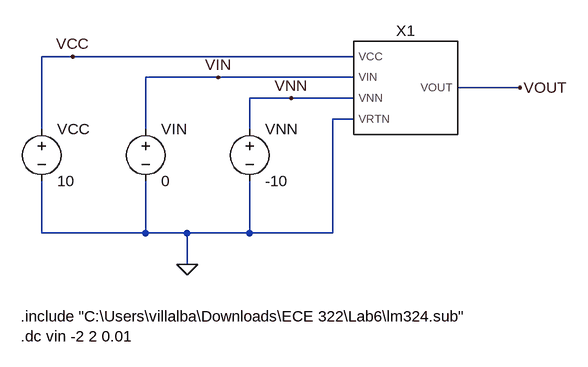
[diagram p0: schematic PreLab6.asc]
PreLab6.asc, the LTspice schematic file:
Version 4
SHEET 1 880 680
WIRE -288 128 -336 128
WIRE 144 128 -288 128
WIRE -64 160 -176 160
WIRE 144 160 -64 160
WIRE 400 176 304 176
WIRE 48 192 -16 192
WIRE 144 192 48 192
WIRE 144 224 112 224
WIRE -336 240 -336 128
WIRE -176 240 -176 160
WIRE -16 240 -16 192
WIRE -336 400 -336 320
WIRE -176 400 -176 320
WIRE -176 400 -336 400
WIRE -112 400 -176 400
WIRE -16 400 -16 320
WIRE -16 400 -112 400
WIRE 112 400 112 224
WIRE 112 400 -16 400
WIRE -112 448 -112 400
FLAG -112 448 0
FLAG 400 176 VOUT
FLAG -64 160 VIN
FLAG -288 128 VCC
FLAG 48 192 VNN
SYMBOL voltage -336 224 R0
WINDOW 123 0 0 Left 0
WINDOW 39 0 0 Left 0
SYMATTR InstName VCC
SYMATTR Value 10
SYMBOL voltage -176 224 R0
WINDOW 123 0 0 Left 0
WINDOW 39 0 0 Left 0
SYMATTR InstName VIN
SYMATTR Value 0
SYMBOL voltage -16 224 R0
WINDOW 123 0 0 Left 0
WINDOW 39 0 0 Left 0
SYMATTR InstName VNN
SYMATTR Value -10
SYMBOL PreLab6_Alex_Villalba.asc 224 176 R0
SYMATTR InstName X1
TEXT -368 528 Left 2 !.include "C:\\Users\\villalba\\Downloads\\ECE 322\\Lab6\\lm324.sub"\n.dc vin -2 2 0.01

The netlist it stands for:
* PreLab6.asc
VCC VCC 0 10
VIN VIN 0 0
VNN VNN 0 -10
XX1 VCC VIN VNN 0 VOUT PreLab6_Alex_Villalba.asc  ; pins VCC VIN VNN VRTN VOUT
.include "C:\Users\villalba\Downloads\ECE 322\Lab6\lm324.sub"
.dc vin -2 2 0.01
.backanno
.end

* Results of the author's LTspice run, read from the files saved beside the schematic
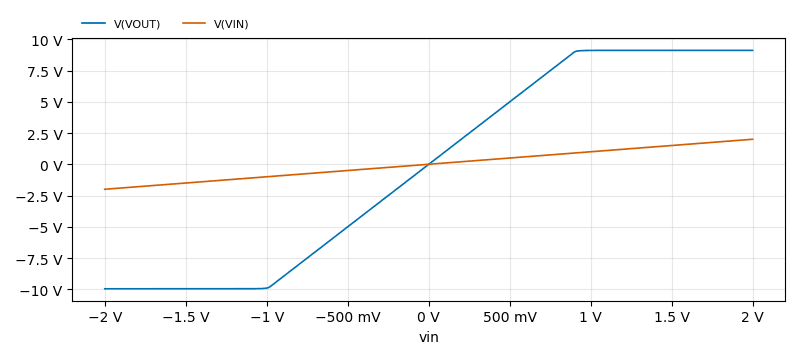
[diagram p1: DC transfer characteristic of PreLab6.asc, plotted from the saved traces]
* DC transfer characteristic, 1 run:
*   V(VOUT): -9.963 V at vin=-2 V, 9.113 V at vin=2 V, min -9.963 V, max 9.113 V
*   V(VIN): -2 V at vin=-2 V, 2 V at vin=2 V, min -2 V, max 2 V